# EAGLE schematic ocd (EAGLE 9.6.0)
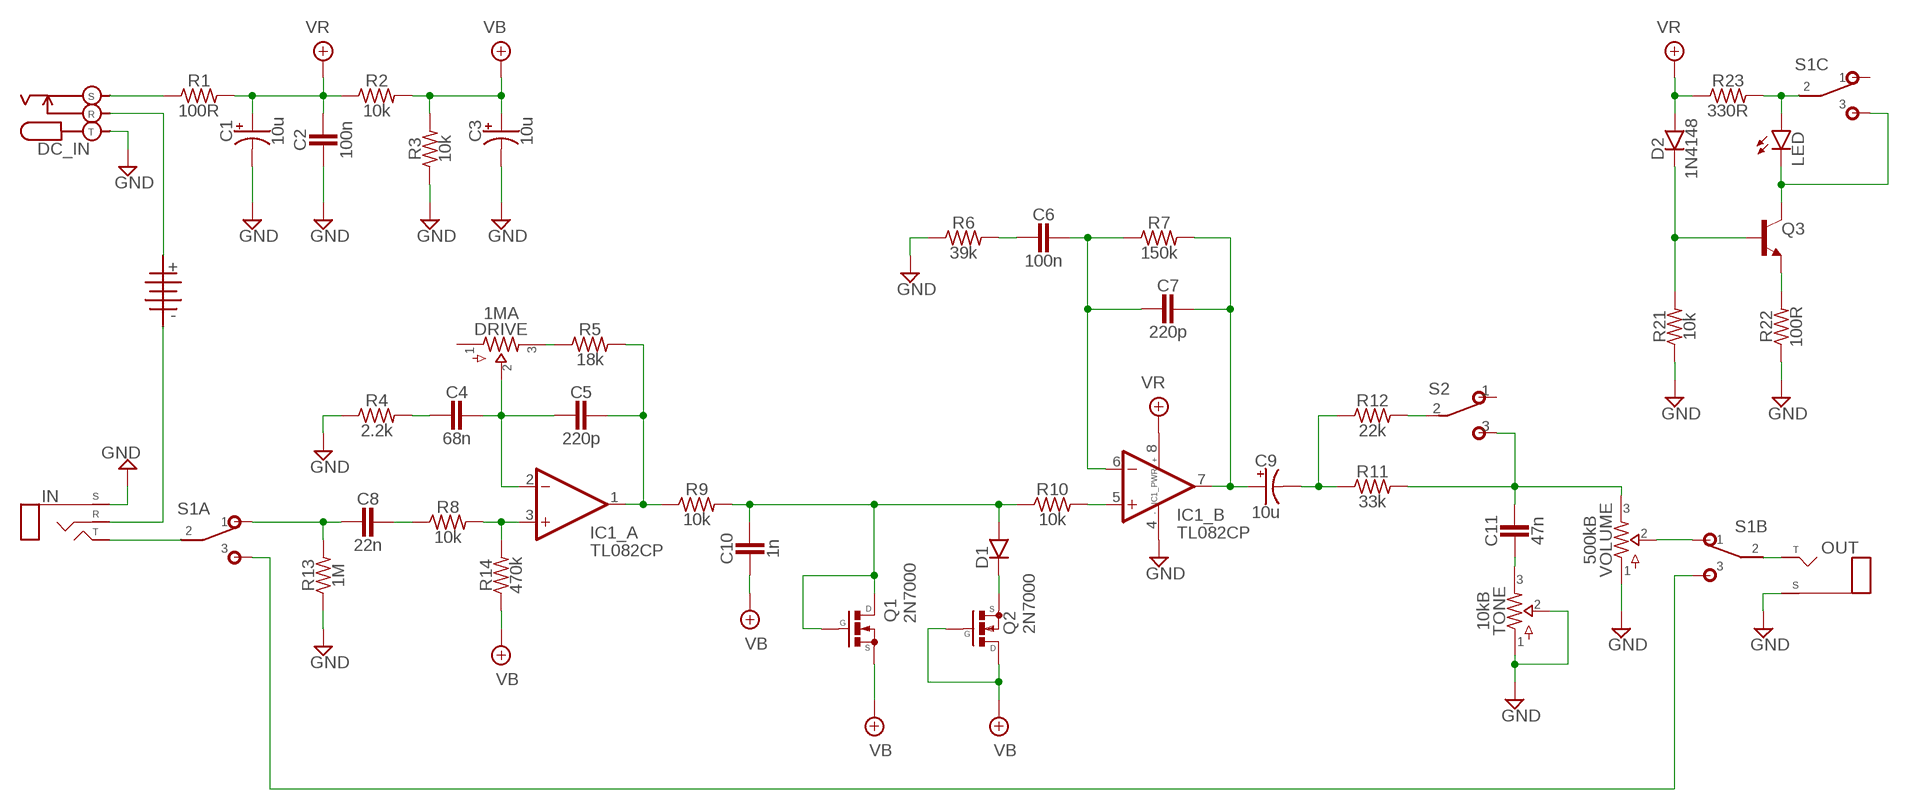
[diagram p0: schematic, sheet 1]

## Parts
1  BATTERY  [TWO_PADS]
C1  10u  0500  [050_020]
C2  100n  CER/FILMBOX.1  [BOX_SMALL]
C3  10u  0500  [050_020]
C4  68n  CER/FILMBOX.1  [BOX_SMALL]
C5  220p  CER/FILMBOX.1  [BOX_SMALL]
C6  100n  CER/FILMBOX.1  [BOX_SMALL]
C7  220p  CER/FILMBOX.1  [BOX_SMALL]
C8  22n  CER/FILMBOX.1  [BOX_SMALL]
C9  10u  0500  [050_020]
C10  1n  CER/FILMBOX.1  [BOX_SMALL]
C11  47n  CER/FILMBOX.1  [BOX_SMALL]
D1  DO41.2  [DO41-2]
D2  1N4148  DO41.2  [DO41-2]
DC_IN  DC_KOBICONNPGR  [PGR]
DRIVE  1MA  POTS16MM  [16MM]
IC1  TL082CP  DUALTH  [DIL0]
IN  STEREO  [STEREO_PCB]
LED  LED  [3MM_D]
OUT  MONO  [TWO_PADS]
Q1  2N7000  [TO92-]
Q2  2N7000  [TO92-]
Q3  2N3904  [TO92-]
R1  100R  R_.3B  [R0207/3]
R2  10k  R_.3B  [R0207/3]
R3  10k  R_.3B  [R0207/3]
R4  2.2k  R_.3B  [R0207/3]
R5  18k  R_.3B  [R0207/3]
R6  39k  R_.3B  [R0207/3]
R7  150k  R_.3B  [R0207/3]
R8  10k  R_.3B  [R0207/3]
R9  10k  R_.3B  [R0207/3]
R10  10k  R_.3B  [R0207/3]
R11  33k  R_.3B  [R0207/3]
R12  22k  R_.3B  [R0207/3]
R13  1M  R_.3B  [R0207/3]
R14  470k  R_.3B  [R0207/3]
R21  10k  R_.3B  [R0207/3]
R22  100R  R_.3B  [R0207/3]
R23  330R  R_.3B  [R0207/3]
S1  3PDT  [3PDT]
S2  SPDT  [M9040P]
TONE  10kB  POTS16MM  [16MM]
VOLUME  500kB  POTS16MM  [16MM]

## Nets
GND: C1.- C2.2 C3.- DC_IN.TIP(T) IC1.4(_PWR:V-) IN.P$1(S) OUT.S(SLEEVE) R3.1 R4.1 R6.1 R13.1 R21.1 R22.1 TONE.1 TONE.2 VOLUME.1
N$1: C9.- R11.1 R12.1
N$2: C8.2 R13.2 S1.A1
N$3: C8.1 R8.1
N$4: IC1.3(_A:+IN) R8.2 R14.2
N$5: C4.1 C5.2 DRIVE.2 IC1.2(_A:-IN)
N$6: DRIVE.3 R5.1
N$7: C5.1 IC1.1(_A:OUT) R5.2 R9.1
N$8: C4.2 R4.2
N$9: IC1.5(_B:+IN) R10.2
N$10: D1.C Q2.3(S)
N$11: C10.1 D1.A Q1.1(D) Q1.2(G) R9.2 R10.1
N$12: C6.1 C7.2 IC1.6(_B:-IN) R7.1
N$13: C7.1 C9.+ IC1.7(_B:OUT) R7.2
N$14: C6.2 R6.2
N$15: R12.2 S2.2(P)
N$16: C11.1 R11.2 S2.3(S) VOLUME.3
N$17: C11.2 TONE.3
N$18: S1.B1 VOLUME.2
N$19: DC_IN.SLEEVE(S) R1.1
N$20: IN.P$3(T) S1.A2
N$21: 1.T DC_IN.RING(R)
N$22: 1.S IN.P$2(R)
N$23: S1.A3 S1.B3
N$24: OUT.T(TIP) S1.B2
N$25: LED.ANODE(A) R23.2 S1.C2
N$26: LED.P$1(C) Q3.1(C) S1.C3
N$27: Q3.3(E) R22.2
N$28: D2.C Q3.2(B) R21.2
VB: C3.+ C10.2 Q1.3(S) Q2.1(D) Q2.2(G) R2.2 R3.2 R14.1
VR: C1.+ C2.1 D2.A IC1.8(_PWR:V+) R1.2 R2.1 R23.1
Unconnected: DRIVE.1 S1.C1 S2.1(O)

## Library data of the parts
1 = pedals-jacks:BATTERY
C1 C3 C9 = pedals-capacitors-elec:050
C2 C4-C8 C10 C11 = pedals-capacitors-film:CER/FILM: 47 - 120pF Xicon Ceramic Disc 2.5mm lead spacing
D1 D2 = pedals-diodes:DO41: DO-41 Package Diodes: 1N4001 - 1N40019 Zener Diodes: 1N4728 - 1N4764
DC_IN = pedals-jacks:DC_KOBICONN
DRIVE TONE VOLUME = pedals-potentiometers:POTS
IC1 = pedals-integrated circuits:DUAL: OP AMP
IN = pedals-jacks:STEREO
LED = pedals-diodes:LED
OUT = pedals-jacks:MONO: Mono 1/4" Phone Jack
Q1 Q2 = pedals-transistors:2N7000
Q3 = pedals-transistors:2N3904: NPN Transistor
R1-R14 R21-R23 = pedals-resistors:R_
S1 = pedals-switches:3PDT
S2 = pedals-switches:SPDT: TOGGLE SWITCH Marquardt